# EAGLE design proto1 (EAGLE 6.1)
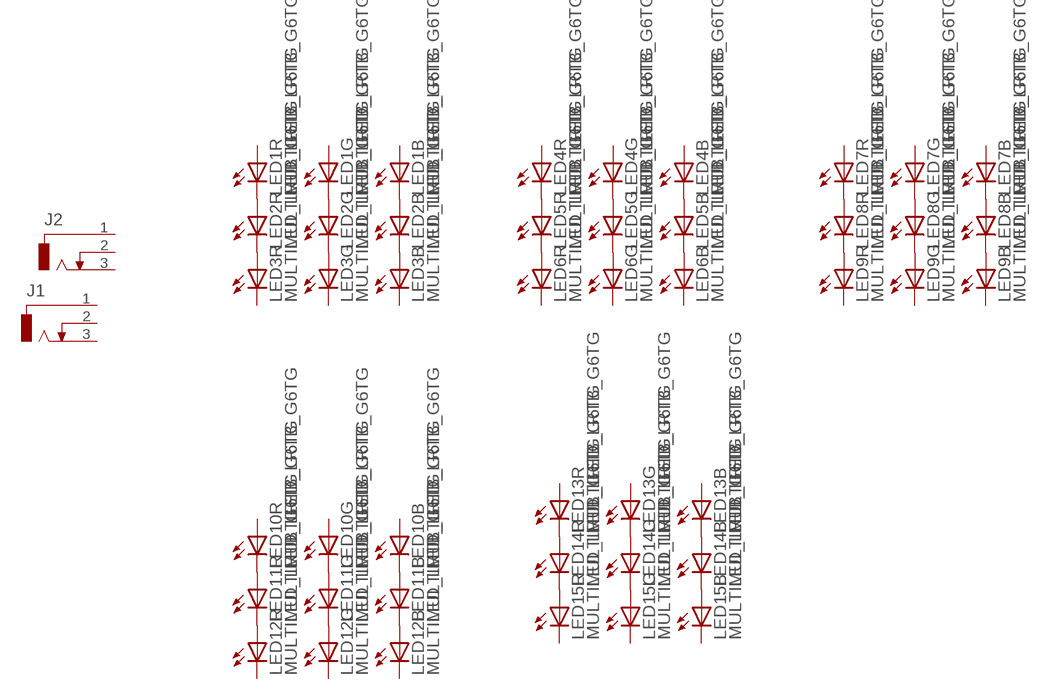
[diagram p0: schematic, sheet 1]

## Parts
J1  DCJ0303  [DCJ0303]
J2  DCJ0303  [DCJ0303]
LED1  MULTILED_LRTB_G6TG  [P-LCC-6_TOPLED]
LED2  MULTILED_LRTB_G6TG  [P-LCC-6_TOPLED]
LED3  MULTILED_LRTB_G6TG  [P-LCC-6_TOPLED]
LED4  MULTILED_LRTB_G6TG  [P-LCC-6_TOPLED]
LED5  MULTILED_LRTB_G6TG  [P-LCC-6_TOPLED]
LED6  MULTILED_LRTB_G6TG  [P-LCC-6_TOPLED]
LED7  MULTILED_LRTB_G6TG  [P-LCC-6_TOPLED]
LED8  MULTILED_LRTB_G6TG  [P-LCC-6_TOPLED]
LED9  MULTILED_LRTB_G6TG  [P-LCC-6_TOPLED]
LED10  MULTILED_LRTB_G6TG  [P-LCC-6_TOPLED]
LED11  MULTILED_LRTB_G6TG  [P-LCC-6_TOPLED]
LED12  MULTILED_LRTB_G6TG  [P-LCC-6_TOPLED]
LED13  MULTILED_LRTB_G6TG  [P-LCC-6_TOPLED]
LED14  MULTILED_LRTB_G6TG  [P-LCC-6_TOPLED]
LED15  MULTILED_LRTB_G6TG  [P-LCC-6_TOPLED]

## Nets
N$1: LED1.C1(R:C) LED2.A1(R:A)
N$2: LED1.C2(G:C) LED2.A2(G:A)
N$3: LED1.C3(B:C) LED2.A3(B:A)
N$4: LED2.C3(B:C) LED3.A3(B:A)
N$5: LED2.C2(G:C) LED3.A2(G:A)
N$6: LED2.C1(R:C) LED3.A1(R:A)
N$7: LED4.C1(R:C) LED5.A1(R:A)
N$8: LED4.C2(G:C) LED5.A2(G:A)
N$9: LED4.C3(B:C) LED5.A3(B:A)
N$10: LED5.C3(B:C) LED6.A3(B:A)
N$11: LED5.C2(G:C) LED6.A2(G:A)
N$12: LED5.C1(R:C) LED6.A1(R:A)
N$13: LED7.C1(R:C) LED8.A1(R:A)
N$14: LED7.C2(G:C) LED8.A2(G:A)
N$15: LED7.C3(B:C) LED8.A3(B:A)
N$16: LED8.C1(R:C) LED9.A1(R:A)
N$17: LED8.C2(G:C) LED9.A2(G:A)
N$18: LED8.C3(B:C) LED9.A3(B:A)
N$19: LED11.C1(R:C) LED12.A1(R:A)
N$20: LED10.C1(R:C) LED11.A1(R:A)
N$21: LED10.C2(G:C) LED11.A2(G:A)
N$22: LED11.C2(G:C) LED12.A2(G:A)
N$23: LED10.C3(B:C) LED11.A3(B:A)
N$24: LED11.C3(B:C) LED12.A3(B:A)
N$25: LED13.C1(R:C) LED14.A1(R:A)
N$26: LED13.C2(G:C) LED14.A2(G:A)
N$27: LED13.C3(B:C) LED14.A3(B:A)
N$28: LED14.C1(R:C) LED15.A1(R:A)
N$29: LED14.C2(G:C) LED15.A2(G:A)
N$30: LED14.C3(B:C) LED15.A3(B:A)
Unconnected: J1.1 J1.2 J1.3 J2.1 J2.2 J2.3 LED1.A1(R:A) LED1.A2(G:A) LED1.A3(B:A) LED3.C1(R:C) LED3.C2(G:C) LED3.C3(B:C) LED4.A1(R:A) LED4.A2(G:A) LED4.A3(B:A) LED6.C1(R:C) LED6.C2(G:C) LED6.C3(B:C) LED7.A1(R:A) LED7.A2(G:A) LED7.A3(B:A) LED9.C1(R:C) LED9.C2(G:C) LED9.C3(B:C) LED10.A1(R:A) LED10.A2(G:A) LED10.A3(B:A) LED12.C1(R:C) LED12.C2(G:C) LED12.C3(B:C) LED13.A1(R:A) LED13.A2(G:A) LED13.A3(B:A) LED15.C1(R:C) LED15.C2(G:C) LED15.C3(B:C)

## Library data of the parts
J1 J2 = con-jack:DCJ0303: DC POWER JACK Source: DCJ0303.pdf; OC_FARNELL: unknown; OC_NEWARK: unknown
LED1-LED15 = led:MULTILED_LRTB_G6TG: 6-lead MULTILED® Enhanced optical Power LED (ThinFilm® / ThinGaN®) Source. OSRAM - LRTB_G6TG.pdf

## Board
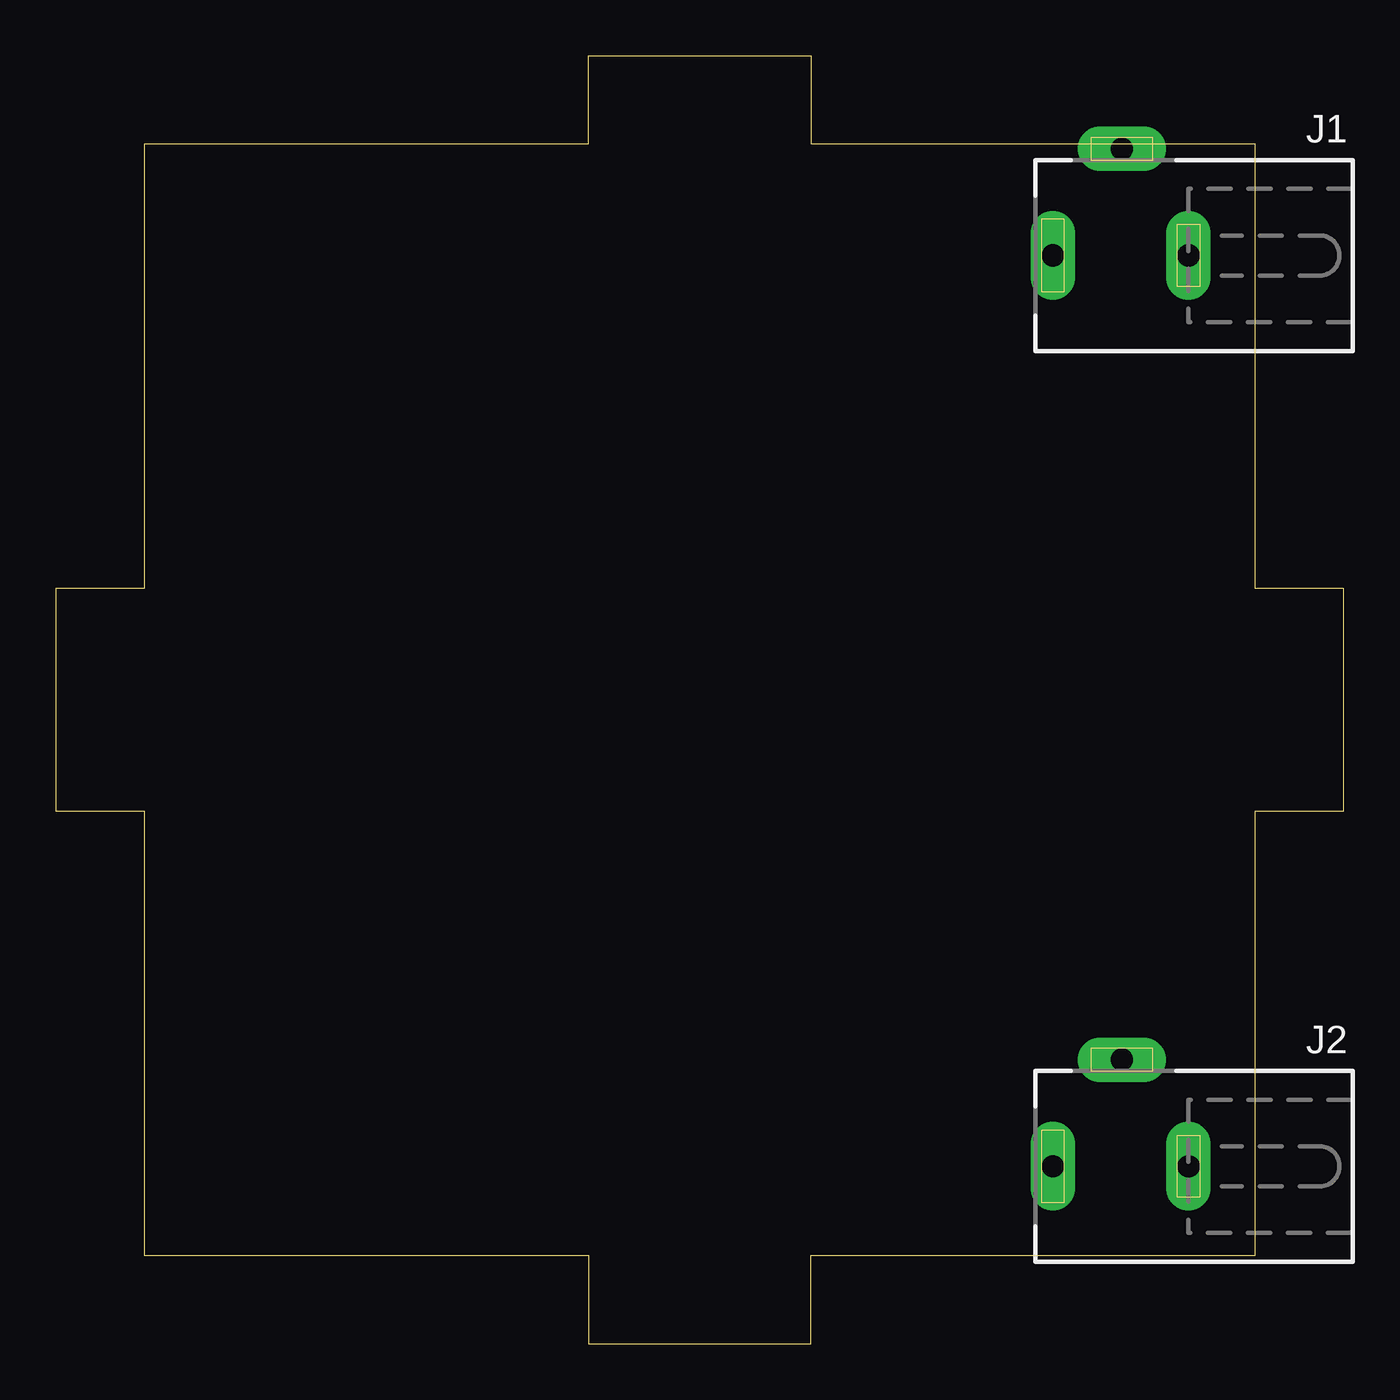
[diagram p1: board, top side]
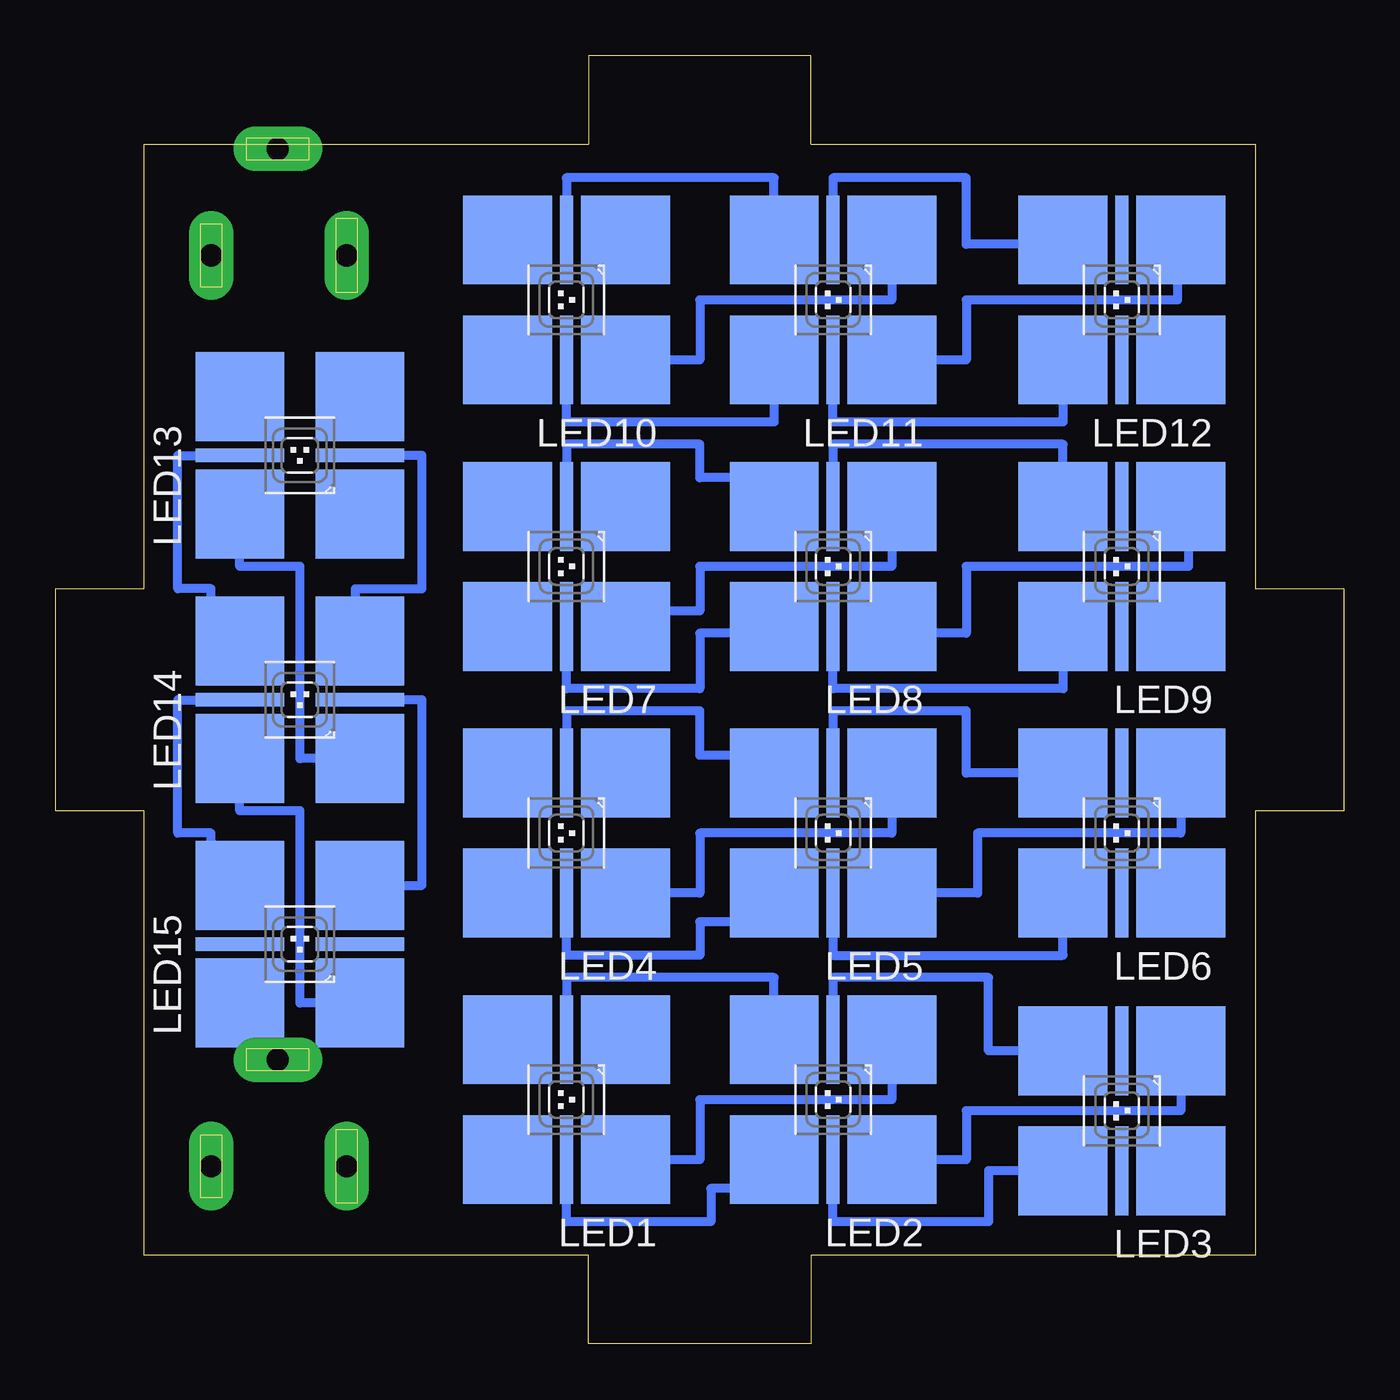
[diagram p2: board, bottom side, seen from below]

Size 58 x 58 mm. Coordinates in mm from the lower left corner, seen from the top.
Outline: 4,54 4,34 0,34 0,24 4,24 4,4 24,4 24,0 34,0 34,4 54,4 54,24 58,24 58,34 54,34 54,54 34,54 34,58 24,58 24,54 4,54
Copper layers (1*16): Top 0.035mm / dielectric 1.5mm / Bottom 0.035mm
Design rules: minimum track width 10mil, minimum drill 24mil, track to track 8mil, track to pad 8mil, pad to pad 8mil, via to via 8mil, smd to smd 8mil, copper to edge 40mil, drill to drill 8mil, minimum pad ring 10mil, minimum via ring 8mil, stop-mask expansion 4mil, vias tented up to drill 0mil, thermal gap 10mil

### Footprints (pad centres in the part's own frame; a part is rotated, then mirrored left to right if it is on the bottom)
DCJ0303 = drill 1 pad 2 long: 1 0,3.1; 2 4.8,0; 3 0,-3
P-LCC-6_TOPLED = smd 4 x 4: A1 -2.65,-2.7; A2 2.65,-2.7; A3 2.65,2.7; C1 -2.65,2.7 | smd 0.6 x 4: C2 0,-2.7; C3 0,2.7

### Placement (x,y rotation side)
J1  48,49 90 top
J2  48,8 90 top
LED1  35,11 180 bottom
LED2  23,11 180 bottom
LED3  10,10.5 180 bottom
LED4  35,23 180 bottom
LED5  23,23 180 bottom
LED6  10,23 180 bottom
LED7  35,35 180 bottom
LED8  23,35 180 bottom
LED9  10,35 180 bottom
LED10  35,47 180 bottom
LED11  23,47 180 bottom
LED12  10,47 180 bottom
LED13  47,40 90 bottom
LED14  47,29 90 bottom
LED15  47,18 90 bottom

### Tracks (layer width: path | path; a pad name or v marks a point on that pad's centre or on a via)
N$1
  Bottom 0.406: LED2.A1 20.35,11 29,11 29,8.3 LED1.C1
N$2
  Bottom 0.406: LED2.A2 25.65,16.5 35,16.5 LED1.C2
N$3
  Bottom 0.406: LED2.A3 25.65,7 28.5,7 28.5,5.5 35,5.5 LED1.C3
N$4
  Bottom 0.406: LED3.A3 16,7.8 16,5.5 23,5.5 LED2.C3
N$5
  Bottom 0.406: LED3.A2 16,13.2 16,16.5 23,16.5 LED2.C2
N$6
  Bottom 0.406: LED3.A1 7.35,10.5 17,10.5 17,8.3 LED2.C1
N$7
  Bottom 0.406: LED5.A1 20.35,23 29,23 29,20.3 LED4.C1
N$8
  Bottom 0.406: LED5.A2 25.65,26.5 29,26.5 29,28.5 35,28.5 LED4.C2
N$9
  Bottom 0.406: LED5.A3 25.65,19 29,19 29,17.5 35,17.5 LED4.C3
N$10
  Bottom 0.406: LED5.C3 23,17.5 12.65,17.5 LED6.A3
N$11
  Bottom 0.406: LED6.A2 17,25.7 17,28.5 23,28.5 LED5.C2
N$12
  Bottom 0.406: LED6.A1 7.35,23 16.5,23 16.5,20.3 LED5.C1
N$13
  Bottom 0.406: LED8.A1 20.35,35 29,35 29,33 32,33 32,32.3 LED7.C1
N$14
  Bottom 0.406: LED8.A2 25.65,39 29,39 29,40.5 35,40.5 LED7.C2
N$15
  Bottom 0.406: LED8.A3 25.65,32 29,32 29,29.5 35,29.5 LED7.C3
N$16
  Bottom 0.406: LED9.A1 7,37.7 7,35 17,35 17,32 20.35,32 LED8.C1
N$17
  Bottom 0.406: LED9.A2 12.65,40.5 23,40.5 LED8.C2
N$18
  Bottom 0.406: LED9.A3 12.65,29.5 23,29.5 LED8.C3
N$19
  Bottom 0.406: LED12.A1 7.5,50.7 7.5,47 17,47 17,44.3 LED11.C1
N$20
  Bottom 0.406: LED11.A1 20.35,47 29,47 29,44.3 LED10.C1
N$21
  Bottom 0.406: LED11.A2 25.65,52.5 35,52.5 LED10.C2
N$22
  Bottom 0.406: LED12.A2 12.65,49.5 17,49.5 17,52.5 23,52.5 LED11.C2
N$23
  Bottom 0.406: LED11.A3 25.65,41.5 35,41.5 LED10.C3
N$24
  Bottom 0.406: LED12.A3 12.65,41.5 23,41.5 LED11.C3
N$25
  Bottom 0.406: LED14.A1 47,26.35 47,35 49.7,35 LED13.C1
N$26
  Bottom 0.406: LED14.A2 44.5,31.65 44.5,34 41.5,34 41.5,40 LED13.C2
N$27
  Bottom 0.406: LED14.A3 51,31.65 51,34 52.5,34 52.5,40 LED13.C3
N$28
  Bottom 0.406: LED15.A1 47,15.35 47,24 49.7,24 LED14.C1
N$29
  Bottom 0.406: LED15.A2 41.5,20.65 41.5,29 LED14.C2
N$30
  Bottom 0.406: LED15.A3 51,19.65 51,23 52.5,23 52.5,29 LED14.C3